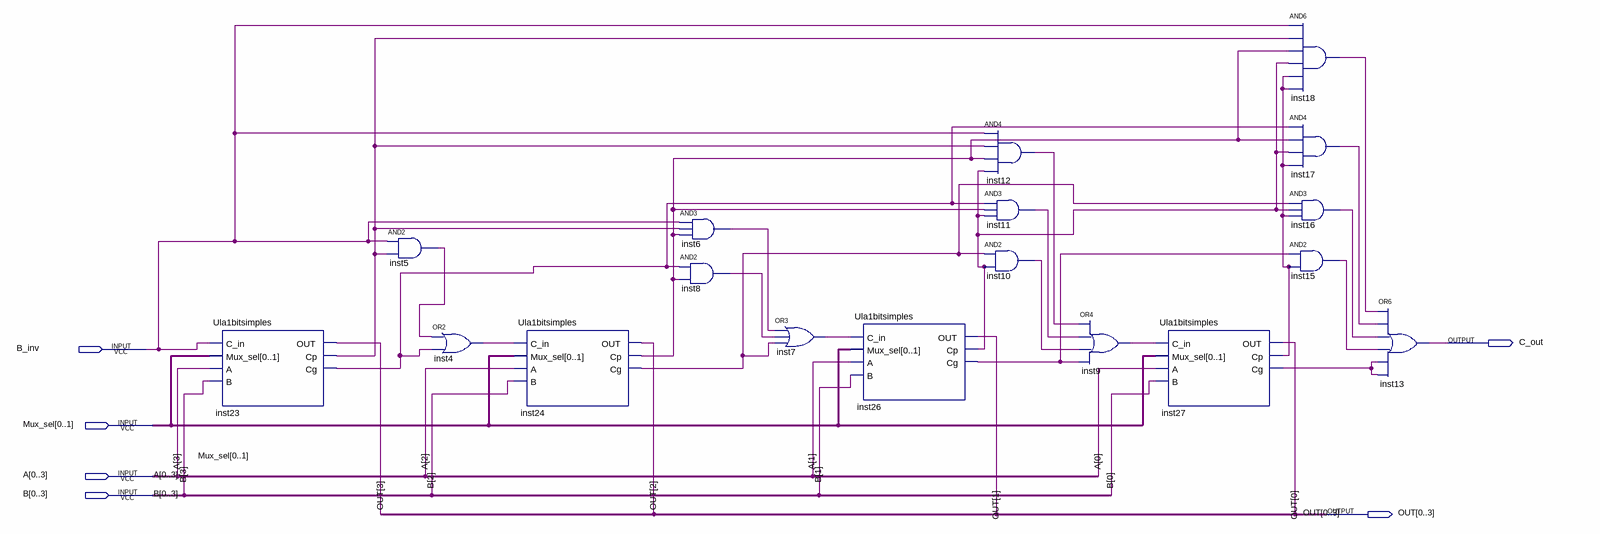
[diagram p0: schematic sheet]
// Quartus schematic Ula4bitssimples.bdf as structural Verilog: 18 symbols, 6 pins
module Ula4bitssimples (
  input  B_inv,
  input  [0:1] Mux_sel,
  input  [0:3] A,
  input  [0:3] B,
  output C_out,
  output [0:3] OUT
);

  wire inst4_out, inst5_out, inst6_out, inst7_out, inst8_out, inst9_out, inst10_out, inst11_out, inst12_out,
       inst15_out, inst16_out, inst17_out, inst18_out, inst23_cg, inst23_cp, inst24_cg, inst24_cp, inst26_cg,
       inst26_cp, inst27_cg, inst27_cp;

  Ula1bitsimples inst23 (
    .C_in(B_inv), .Mux_sel(Mux_sel), .A(A[3]), .B(B[3]), .OUT(OUT[3]), .Cp(inst23_cp), .Cg(inst23_cg));
  and inst5 (inst5_out, B_inv, inst23_cp);
  or inst4 (inst4_out, inst5_out, inst23_cg);
  Ula1bitsimples inst24 (
    .C_in(inst4_out), .Mux_sel(Mux_sel), .A(A[2]), .B(B[2]), .OUT(OUT[2]), .Cp(inst24_cp), .Cg(inst24_cg));
  and inst6 (inst6_out, B_inv, inst23_cp, inst24_cp);
  and inst8 (inst8_out, inst23_cg, inst24_cp);
  or inst7 (inst7_out, inst6_out, inst8_out, inst24_cg);
  Ula1bitsimples inst26 (
    .C_in(inst7_out), .Mux_sel(Mux_sel), .A(A[1]), .B(B[1]), .OUT(OUT[1]), .Cp(inst26_cp), .Cg(inst26_cg));
  and inst12 (inst12_out, B_inv, inst23_cp, inst24_cp, inst26_cp);
  and inst11 (inst11_out, inst23_cg, inst24_cp, inst26_cp);
  and inst10 (inst10_out, inst24_cg, inst26_cp);
  or inst9 (inst9_out, inst12_out, inst11_out, inst10_out, inst26_cg);
  Ula1bitsimples inst27 (
    .C_in(inst9_out), .Mux_sel(Mux_sel), .A(A[0]), .B(B[0]), .OUT(OUT[0]), .Cp(inst27_cp), .Cg(inst27_cg));
  and inst18 (inst18_out, B_inv, inst23_cp, inst24_cp, inst26_cp, inst27_cp, inst27_cp);
  and inst17 (inst17_out, inst23_cg, inst24_cp, inst26_cp, inst27_cp);
  and inst16 (inst16_out, inst24_cg, inst26_cp, inst27_cp);
  and inst15 (inst15_out, inst26_cg, inst27_cp);
  or inst13 (C_out, inst18_out, inst17_out, inst16_out, inst15_out, inst27_cg, inst27_cg);
endmodule
